# EAGLE schematic ESP_nixie_clock (EAGLE 9.5.2)
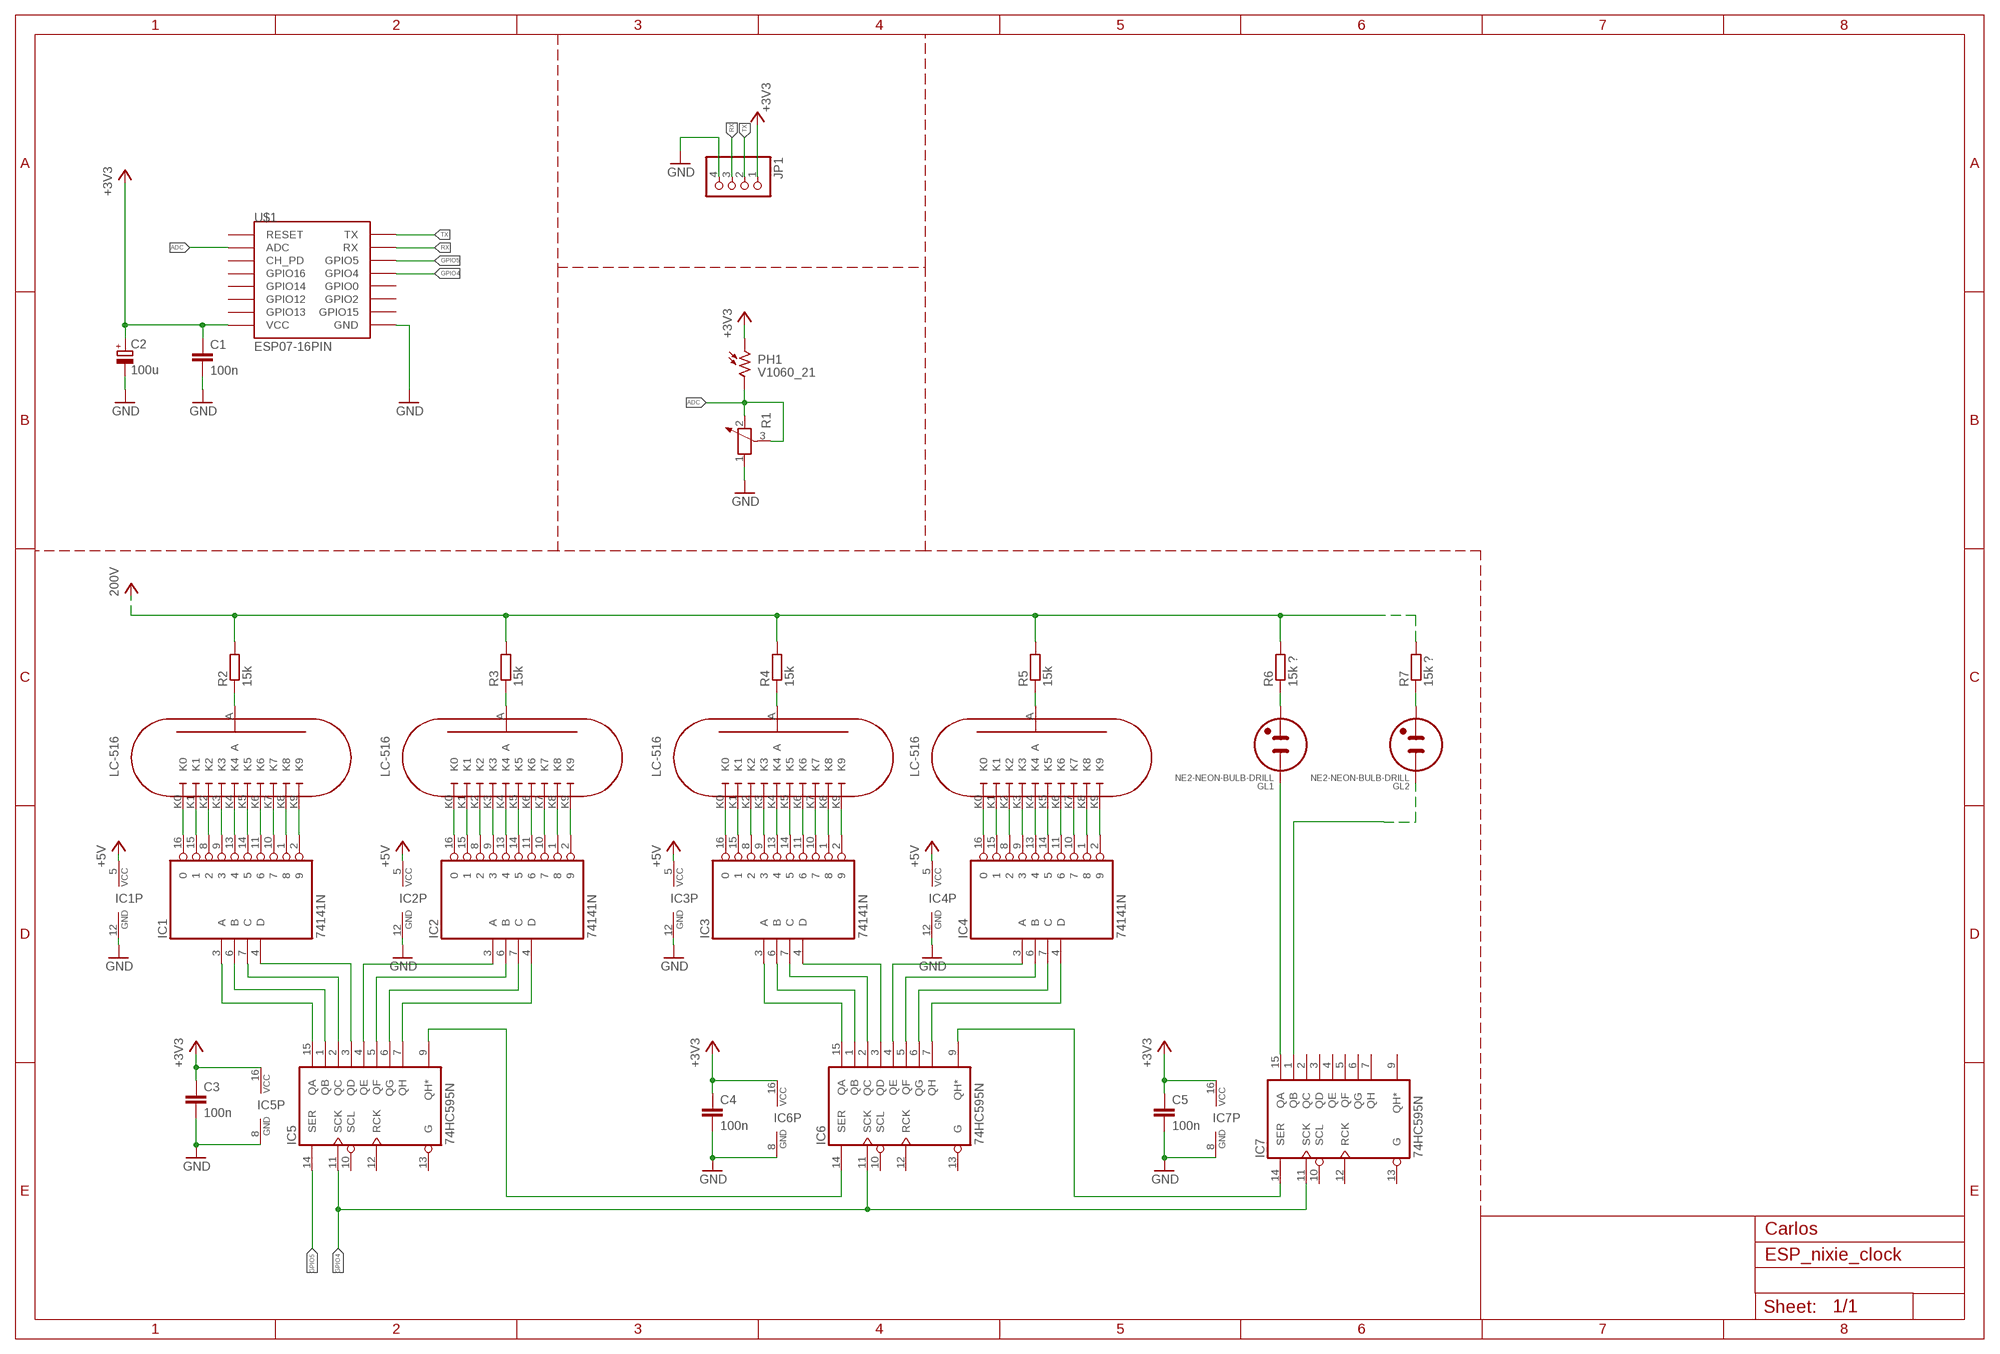
[diagram p0: schematic, sheet 1]

## Parts
C1  100n  C-EUC0805K  [C0805K]
C2  100u  CPOL-EU153CLV-0810  [153CLV-0810]
C3  100n  C-EUC0805K  [C0805K]
C4  100n  C-EUC0805K  [C0805K]
C5  100n  C-EUC0805K  [C0805K]
GL1  NE2-NEON-BULB-DRILL  [NE2-NEON-BULB-DRILL]
GL2  NE2-NEON-BULB-DRILL  [NE2-NEON-BULB-DRILL]
IC1  74141N  [DIL16]
IC2  74141N  [DIL16]
IC3  74141N  [DIL16]
IC4  74141N  [DIL16]
IC5  74HC595N  [DIL16]
IC6  74HC595N  [DIL16]
IC7  74HC595N  [DIL16]
JP1  PINHD-1X4/90  [1X04/90]
PH1  V1060_21  [TO-5_V10]
R1  POTENTIOMETER_PT-10  [PT-10]
R2  15k  R-EU_0207/10  [0207/10]
R3  15k  R-EU_0207/10  [0207/10]
R4  15k  R-EU_0207/10  [0207/10]
R5  15k  R-EU_0207/10  [0207/10]
R6  15k ?  R-EU_0207/10  [0207/10]
R7  15k ?  R-EU_0207/10  [0207/10]
U$1  ESP07-16PIN  [ESP07-16PIN]
U$2  LC-516  [LC-516]
U$3  LC-516  [LC-516]
U$4  LC-516  [LC-516]
U$5  LC-516  [LC-516]

## Nets
+3V3: C1.1 C2.+ C3.1 C4.1 C5.1 IC5.16(VCC) IC6.16(VCC) IC7.16(VCC) JP1.1 PH1.1 U$1.VCC
+5V: IC1.5(VCC) IC2.5(VCC) IC3.5(VCC) IC4.5(VCC)
ADC: PH1.2 R1.2 R1.3 U$1.ADC
GND: C1.2 C2.- C3.2 C4.2 C5.2 IC1.12(GND) IC2.12(GND) IC3.12(GND) IC4.12(GND) IC5.8(GND) IC6.8(GND) IC7.8(GND) JP1.4 R1.1 U$1.GND
GPIO4: IC5.11(SCK) IC6.11(SCK) IC7.11(SCK) U$1.GPIO5(GPIO4)
GPIO5: IC5.14(SER) U$1.GPIO4(GPIO5)
N$1: IC1.16 U$2.K0
N$2: IC1.15 U$2.K1
N$3: IC1.8 U$2.K2
N$4: IC1.9 U$2.K3
N$5: IC1.13 U$2.K4
N$6: IC1.11 U$2.K6
N$7: IC1.14 U$2.K5
N$8: IC1.10 U$2.K7
N$9: IC1.1 U$2.K8
N$10: IC1.2 U$2.K9
N$11: IC2.16 U$3.K0
N$12: IC2.15 U$3.K1
N$13: IC2.8 U$3.K2
N$14: IC2.9 U$3.K3
N$15: IC2.13 U$3.K4
N$16: IC2.14 U$3.K5
N$17: IC2.11 U$3.K6
N$18: IC2.10 U$3.K7
N$19: IC2.1 U$3.K8
N$20: IC2.2 U$3.K9
N$21: IC3.16 U$4.K0
N$22: IC3.15 U$4.K1
N$23: IC3.8 U$4.K2
N$24: IC3.9 U$4.K3
N$25: IC3.13 U$4.K4
N$26: IC3.14 U$4.K5
N$27: IC3.11 U$4.K6
N$28: IC3.10 U$4.K7
N$29: IC3.1 U$4.K8
N$30: IC3.2 U$4.K9
N$31: IC4.16 U$5.K0
N$32: IC4.15 U$5.K1
N$33: IC4.8 U$5.K2
N$34: IC4.9 U$5.K3
N$35: IC4.13 U$5.K4
N$36: IC4.14 U$5.K5
N$37: IC4.11 U$5.K6
N$38: IC4.10 U$5.K7
N$39: IC4.1 U$5.K8
N$40: IC4.2 U$5.K9
N$41: IC1.3(A) IC5.15(QA)
N$42: IC1.6(B) IC5.1(QB)
N$43: IC1.7(C) IC5.2(QC)
N$44: IC1.4(D) IC5.3(QD)
N$45: IC2.3(A) IC5.4(QE)
N$46: IC2.6(B) IC5.5(QF)
N$47: IC2.7(C) IC5.6(QG)
N$48: IC2.4(D) IC5.7(QH)
N$49: IC5.9(QH*) IC6.14(SER)
N$50: IC3.3(A) IC6.15(QA)
N$51: IC3.6(B) IC6.1(QB)
N$52: IC3.7(C) IC6.2(QC)
N$53: IC3.4(D) IC6.3(QD)
N$54: IC4.3(A) IC6.4(QE)
N$55: IC4.6(B) IC6.5(QF)
N$56: IC4.7(C) IC6.6(QG)
N$57: IC4.4(D) IC6.7(QH)
N$58: IC6.9(QH*) IC7.14(SER)
N$59: R2.1 U$2.A
N$60: GL1.1(A) IC7.15(QA)
N$61: GL2.1(A) IC7.1(QB)
N$62: R3.1 U$3.A
N$63: R4.1 U$4.A
N$64: R5.1 U$5.A
N$65: GL1.2(A1) R6.1
N$66: GL2.2(A1) R7.1
RX: JP1.3 U$1.RX
TX: JP1.2 U$1.TX
VCC: R2.2 R3.2 R4.2 R5.2 R6.2 R7.2 ; supply symbol labelled 200V
Unconnected: IC5.10(SCL) IC5.12(RCK) IC5.13(G) IC6.10(SCL) IC6.12(RCK) IC6.13(G) IC7.2(QC) IC7.3(QD) IC7.4(QE) IC7.5(QF) IC7.6(QG) IC7.7(QH) IC7.9(QH*) IC7.10(SCL) IC7.12(RCK) IC7.13(G) U$1.CH_PD U$1.GPIO0 U$1.GPIO2 U$1.GPIO12 U$1.GPIO13 U$1.GPIO14 U$1.GPIO15 U$1.GPIO16 U$1.REST(RESET)

## Notes on the sheet
- Carlos

## Library data of the parts
C1 C3-C5 = rcl:C-EU: CAPACITOR, European symbol; SPICEPREFIX: C
C2 = rcl:CPOL-EU: POLARIZED CAPACITOR, European symbol; SPICEPREFIX: C
GL1 GL2 = nixie_tube:NE2-NEON-BULB: Neon indicator (wire connection)
IC1-IC4 = 74xx-eu:74*141: BCD to decimal DECODER/DRIVER
IC5-IC7 = 74xx-eu:74*595: 8-bit SHIFT REGISTER, output latch
JP1 = pinhead:PINHD-1X4: PIN HEADER
PH1 = photo-elements:?1060*: Sensor Street Light control Source: http://optoelectronics.perkinelmer.com/content/Datasheets/DTS_PhotocellsB1060.pdf
R1 = rcl:POTENTIOMETER_: Potentiometer; SPICEMODEL: POT; SPICEPREFIX: X
R2-R7 = rcl:R-EU_: RESISTOR, European symbol; SPICEPREFIX: R
U$1 = esp8266modules:ESP07-16PIN: ESP8266 Wifi module 07 - 16 pins; DIMENSIONS: 22.0 x 16.0 mm; PINS: 16; PITCH: 0.078" / 2 mm
U$2-U$5 = LC-516:LC-516: Nixie Tube LC-516